# EAGLE design untitled (EAGLE 9.6.2)
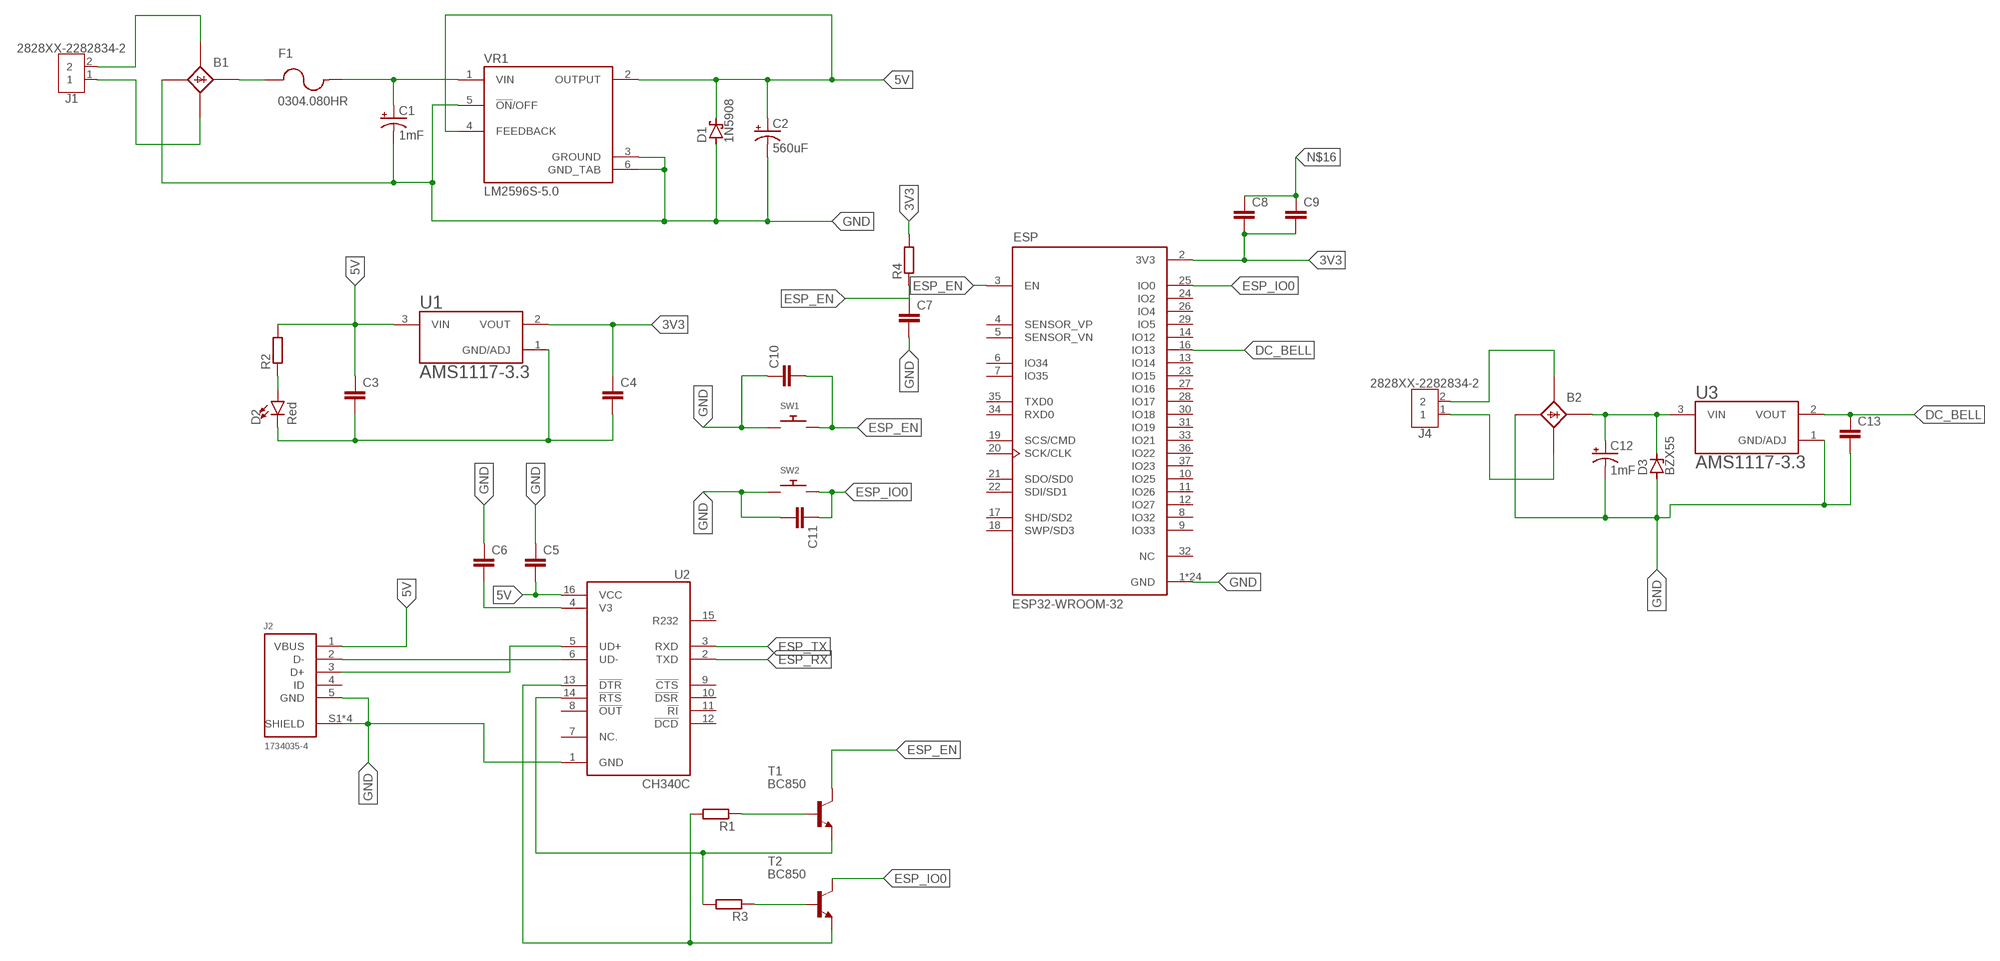
[diagram p0: schematic, sheet 1]

## Parts
B1  B25A-  [B25A-]
B2  B25A-  [B25A-]
C1  1mF  1000UF-RADIAL-5MM-25V-20%  [CPOL-RADIAL-5MM-10MM]
C2  560uF  560UF-PANASONIC_G-25V-20%  [PANASONIC_G]
C3  C-EUC1206K  [C1206K]
C4  C-EUC1206K  [C1206K]
C5  C-EUC1206K  [C1206K]
C6  C-EUC1206K  [C1206K]
C7  C-EUC1206K  [C1206K]
C8  C-EUC1206K  [C1206K]
C9  C-EUC1206K  [C1206K]
C10  C-EUC1206K  [C1206K]
C11  C-EUC1206K  [C1206K]
C12  1mF  1000UF-RADIAL-5MM-25V-20%  [CPOL-RADIAL-5MM-10MM]
C13  C-EUC1206K  [C1206K]
D1  1N5908  [C4111-15]
D2  Red  LED-RED-0603-WE  [LED-0603]
D3  BZX55  [DO35Z10]
ESP  ESP32-WROOM-32  [MODULE_ESP32-WROOM-32]
F1  0304.080HR  [0304.080HR]
J1  2828XX-2282834-2  [TERMBLK_254-2N]
J2  1734035-4  [1734035-4]
J4  2828XX-2282834-2  [TERMBLK_254-2N]
R1  R-EU_R5025W  [R5025W]
R2  R-EU_R5025W  [R5025W]
R3  R-EU_R5025W  [R5025W]
R4  R-EU_R5025W  [R5025W]
SW1  SWITCH_PUSHBUTTONSOFTTOUCHSMD_SJ  [PUSHBUTTON_SMD_SJ]
SW2  SWITCH_PUSHBUTTONSOFTTOUCHSMD_SJ  [PUSHBUTTON_SMD_SJ]
T1  BC850  [SOT23]
T2  BC850  [SOT23]
U1  AMS1117-3.3  [SOT229P700X180-4N]
U2  CH340C  [SOIC127P600X180-16N]
U3  AMS1117-3.3  [SOT229P700X180-4N]
VR1  LM2596S-5.0  [TO170P1524X483-6N]

## Nets
3V3: C4.1 C8.2 C9.2 ESP.2(3V3) R4.2 U1.2(VOUT)
5V: C2.+ C3.1 C5.2 D1.C J2.1(VBUS) R2.2 U1.3(VIN) U2.16(VCC) VR1.2(OUTPUT) VR1.4(FEEDBACK)
DC_BELL: C13.1 ESP.16(IO13) U3.2(VOUT)
ESP_EN: C7.1 C10.2 ESP.3(EN) R4.1 SW1.P$2 T1.3(C)
ESP_IO0: C11.1 ESP.25(IO0) SW2.P$2 T2.3(C)
ESP_RX: U2.2(TXD)
ESP_TX: U2.3(RXD)
GND: B1.-1(-) B2.-1(-) C1.- C2.- C5.1 C6.1 C7.2 C10.1 C11.2 C12.- C13.2 D1.A D3.A ESP.1(GND) ESP.15(GND) ESP.38(GND) ESP.39_1(GND) ESP.39_2(GND) ESP.39_3(GND) ESP.39_4(GND) ESP.39_5(GND) ESP.39_6(GND) ESP.39_7(GND) ESP.39_8(GND) ESP.39_9(GND) ESP.39_10(GND) ESP.39_11(GND) ESP.39_12(GND) ESP.39_13(GND) ESP.39_14(GND) ESP.39_15(GND) ESP.39_16(GND) ESP.39_17(GND) ESP.39_18(GND) ESP.39_19(GND) ESP.39_20(GND) ESP.39_21(GND) J2.5(GND) J2.S1(SHIELD) J2.S2(SHIELD) J2.S3(SHIELD) J2.S4(SHIELD) SW1.P$1 SW2.P$1 U2.1(GND) U3.1(GND/ADJ) VR1.3(GROUND) VR1.5(!ON!/OFF) VR1.6(GND_TAB)
N$1: B1.AC1-(AC1) J1.2
N$2: B1.AC2-(AC2) J1.1
N$3: B1.+1(+) F1.1
N$4: C1.+ F1.2 VR1.1(VIN)
N$5: D2.A R2.1
N$6: C3.2 C4.2 D2.C U1.1(GND/ADJ)
N$7: J2.3(D+) U2.5(UD+)
N$8: J2.2(D-) U2.6(UD-)
N$9: B2.AC1-(AC1) J4.2
N$10: B2.AC2-(AC2) J4.1
N$11: C6.2 U2.4(V3)
N$12: R1.1 T1.1(B)
N$13: R3.1 T2.1(B)
N$14: R3.2 T1.2(E) U2.14(!RTS)
N$15: R1.2 T2.2(E) U2.13(!DTR)
N$16: C8.1 C9.1
N$17: B2.+1(+) C12.+ D3.C U3.3(VIN)
Unconnected: B1.+ B1.- B1.AC1 B1.AC2 B2.+ B2.- B2.AC1 B2.AC2 ESP.4(SENSOR_VP) ESP.5(SENSOR_VN) ESP.6(IO34) ESP.7(IO35) ESP.8(IO32) ESP.9(IO33) ESP.10(IO25) ESP.11(IO26) ESP.12(IO27) ESP.13(IO14) ESP.14(IO12) ESP.17(SHD/SD2) ESP.18(SWP/SD3) ESP.19(SCS/CMD) ESP.20(SCK/CLK) ESP.21(SDO/SD0) ESP.22(SDI/SD1) ESP.23(IO15) ESP.24(IO2) ESP.26(IO4) ESP.27(IO16) ESP.28(IO17) ESP.29(IO5) ESP.30(IO18) ESP.31(IO19) ESP.32(NC) ESP.33(IO21) ESP.34(RXD0) ESP.35(TXD0) ESP.36(IO22) ESP.37(IO23) J2.4(ID) U2.7(NC.) U2.8(!OUT) U2.9(!CTS) U2.10(!DSR) U2.11(!RI) U2.12(!DCD) U2.15(R232)

## Library data of the parts
B1 B2 = rectifier:B25A-: RECTIFIER 25-A bridge
C1 C12 = SparkFun-Capacitors:1000UF: 1,000µF/1mF ceramic capacitors A capacitor is a passive two-terminal electrical component used to store electrical energy temporarily in an electric field. CAP-08070; PROD_ID: CAP-09538
C2 = SparkFun-Capacitors:560UF: 560µF polarized capacitors A capacitor is a passive two-terminal electrical component used to store electrical energy temporarily in an electric field.; PROD_ID: CAP-09983
C3-C11 C13 = rcl:C-EU: CAPACITOR, European symbol; SPICEPREFIX: C
D1 = diode:1N5908: DIODE schottky
D2 = SparkFun-LED:LED-RED: Red SMD LED Used in manufacturing of most products at SparkFun Packages: 0603 - KB - KingBright (DIO-17976) SMD 0603 package [Datasheet] <https://www.kingbrightusa.com/images/catalog/SPEC/APT1608SURCK.pdf> 0603 - (DIO-00819, has gone EOL) SMD 0603 package 0603 SMART - SMD 0603 SMART package ( more efficient and expensive)[Product Link] <http://www.osram-os.com/Graphics/XPic2/00077099_0.pdf> 1206 - SMD1206 package [Product Link] <https://www.sparkfun.com/datasheets/DevTools/LilyPad/Q150OVS4.pdff> SparkFun Products: Pro Mini 328 -5V <https://www.sparkfun.com/products/821> RedBoard <https://www.sparkfun.com/products/12757> IOIO-OTG <https://www.sparkfun.com/products/13613>; PROD_ID: DIO-16511
D3 = diode:BZX55: Z DIODE
ESP = ESP32-WROOM-32:ESP32-WROOM-32: Check availability <https://pricing.snapeda.com/parts/ESP32-WROOM-32/Espressif%20Systems/view-part?ref=eda>; AVAILABILITY: In Stock; CHECK_PRICES: https://www.snapeda.com/parts/ESP32-WROOM-32/Espressif+Systems/view-part/?ref=eda; DESCRIPTION: Bluetooth, WiFi 802.11b/g/n, Bluetooth v4.2 +EDR, Class 1, 2 and 3 Transceiver Module 2.4GHz ~ 2.5GHz Antenna Not Included, U.FL Surface Mount; MF: Espressif Systems; MP: ESP32-WROOM-32; PACKAGE: None; PRICE: None; SNAPEDA_LINK: https://www.snapeda.com/parts/ESP32-WROOM-32/Espressif+Systems/view-part/?ref=snap
F1 = Fuse:0304.080HR: FUSE BRD MNT 80MA 277VAC/DC 2SMD Manufacturer's datasheet <https://media.digikey.com/pdf/Data%20Sheets/Littelfuse%20PDFs/304_Series_Prelim.pdf>; CREATED_BY: PCBLayout.com; DIGIKEY_PARTNP: F8233TR-ND; MANUFACTURER: Littelfuse Inc.; MPN: 0304.080HR
J1 J4 = Connector:2828XX-2: 2 Position Wire to Board Terminal Block Horizontal with Board Datasheet <https://www.te.com.cn/commerce/DocumentDelivery/DDEController?Action=showdoc&DocId=Catalog+Section%7F1308389_EUROSTYLE_TERMINAL_BLOCKS%7F0607%7Fpdf%7FEnglish%7FENG_CS_1308389_EUROSTYLE_TERMINAL_BLOCKS_0607.pdf%7F2-282837-5>; CATEGORY: Fixed Terminal Blocks; DESCRIPTION: Fixed Terminal Blocks 2P SIDE ENTRY 2.54mm; MANUFACTURER: TE Connectivity AMP Connectors; MPN: 282834-2; OPERATING_TEMPERATURE: -40°C ~ 105°C; PART_STATUS: Active; PITCH: 0.100" (2.54mm); ROHS_COMPLIANCE: RoHS Compliant; SERIES: Buchanan; SUBCATEGORY: Terminal Blocks; TYPE: Through Hole; Screw - Rising Cage Clamp; Side wire entry, Horizontal with Board
J2 = USB connector:1734035-4: CONN RCPT USB2.0 MINI B SMD R/A Manufacturer's datasheet <https://www.te.com/commerce/DocumentDelivery/DDEController?Action=srchrtrv&DocNm=1734035&DocType=Customer+Drawing&DocLang=English>; CREATED_BY: PCBLayout.com; DIGIKEY_PARTNO: A121554TR-ND; MANUFACTURER: TE Connectivity AMP Connectors; MPN: 1734035-4
R1-R4 = rcl:R-EU_: RESISTOR, European symbol; SPICEPREFIX: R
SW1 SW2 = adafruit:SWITCH_PUSHBUTTON: Buttons SOFTTOUCHSMD_SJ - Soft touch temporary push button (Super Junk Akihabara) Compatible with SKPMANE010 [Mouser: 688-SKPMAN] C&K_KSS = Digikey: KSS221GLFS
T1 T2 = transistor:BC850: NPN TRANSISTOR
U1 U3 = AMS1117-3.3:AMS1117-3.3: Check availability <https://pricing.snapeda.com/parts/AMS1117-3.3/Advanced%20Monolithic%20Systems/view-part?ref=eda>; AVAILABILITY: Not in stock; CHECK_PRICES: https://www.snapeda.com/parts/AMS1117-3.3/Advanced+Monolithic+Systems/view-part/?ref=eda; DESCRIPTION: Sot223/Pkg 1-Amp 3.3-Volt Low Drop Out Voltage Regulatator; MF: Advanced Monolithic Systems; MP: AMS1117-3.3; PACKAGE: SOT-223 Seeed Technology; PRICE: None; SNAPEDA_LINK: https://www.snapeda.com/parts/AMS1117-3.3/Advanced+Monolithic+Systems/view-part/?ref=snap
U2 = CH340C:CH340C: USB to serial chip CH340 Check availability <https://pricing.snapeda.com/parts/CH340C/WCH/view-part?ref=eda>; AVAILABILITY: Not in stock; CHECK_PRICES: https://www.snapeda.com/parts/CH340C/WCH/view-part/?ref=eda; DESCRIPTION: USB to serial chip CH340; MF: WCH; MP: CH340C; PACKAGE: None; PRICE: None; SNAPEDA_LINK: https://www.snapeda.com/parts/CH340C/WCH/view-part/?ref=snap
VR1 = LM2596S-5.0:LM2596S-5.0: Check availability <https://pricing.snapeda.com/parts/LM2596S-5.0/Texas/view-part?ref=eda>; AVAILABILITY: In Stock; CHECK_PRICES: https://www.snapeda.com/parts/LM2596S-5.0/Texas+Instruments/view-part/?ref=eda; DESCRIPTION: SIMPLE SWITCHER® 4.5V to 40V, 3A Low Component Count Step-Down Regulator 5-DDPAK/TO-263; MF: Texas; MP: LM2596S-5.0; PACKAGE: TO-263-6 National Semiconductor; PRICE: None; SNAPEDA_LINK: https://www.snapeda.com/parts/LM2596S-5.0/Texas+Instruments/view-part/?ref=snap

## Board
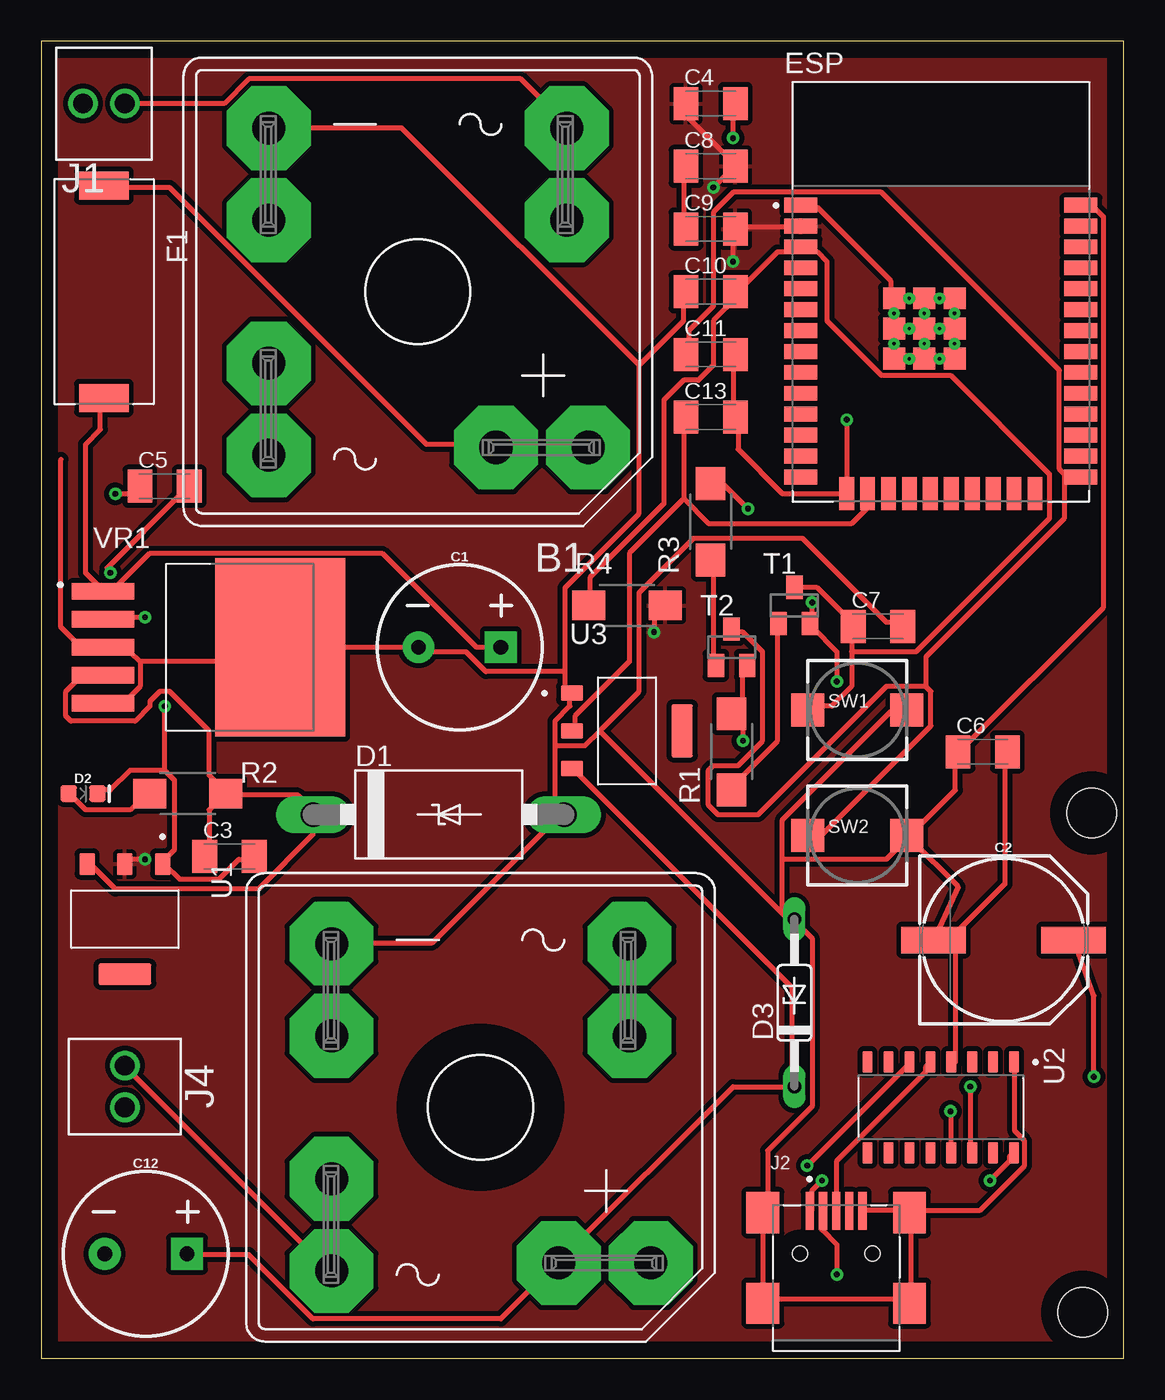
[diagram p1: board, top side]
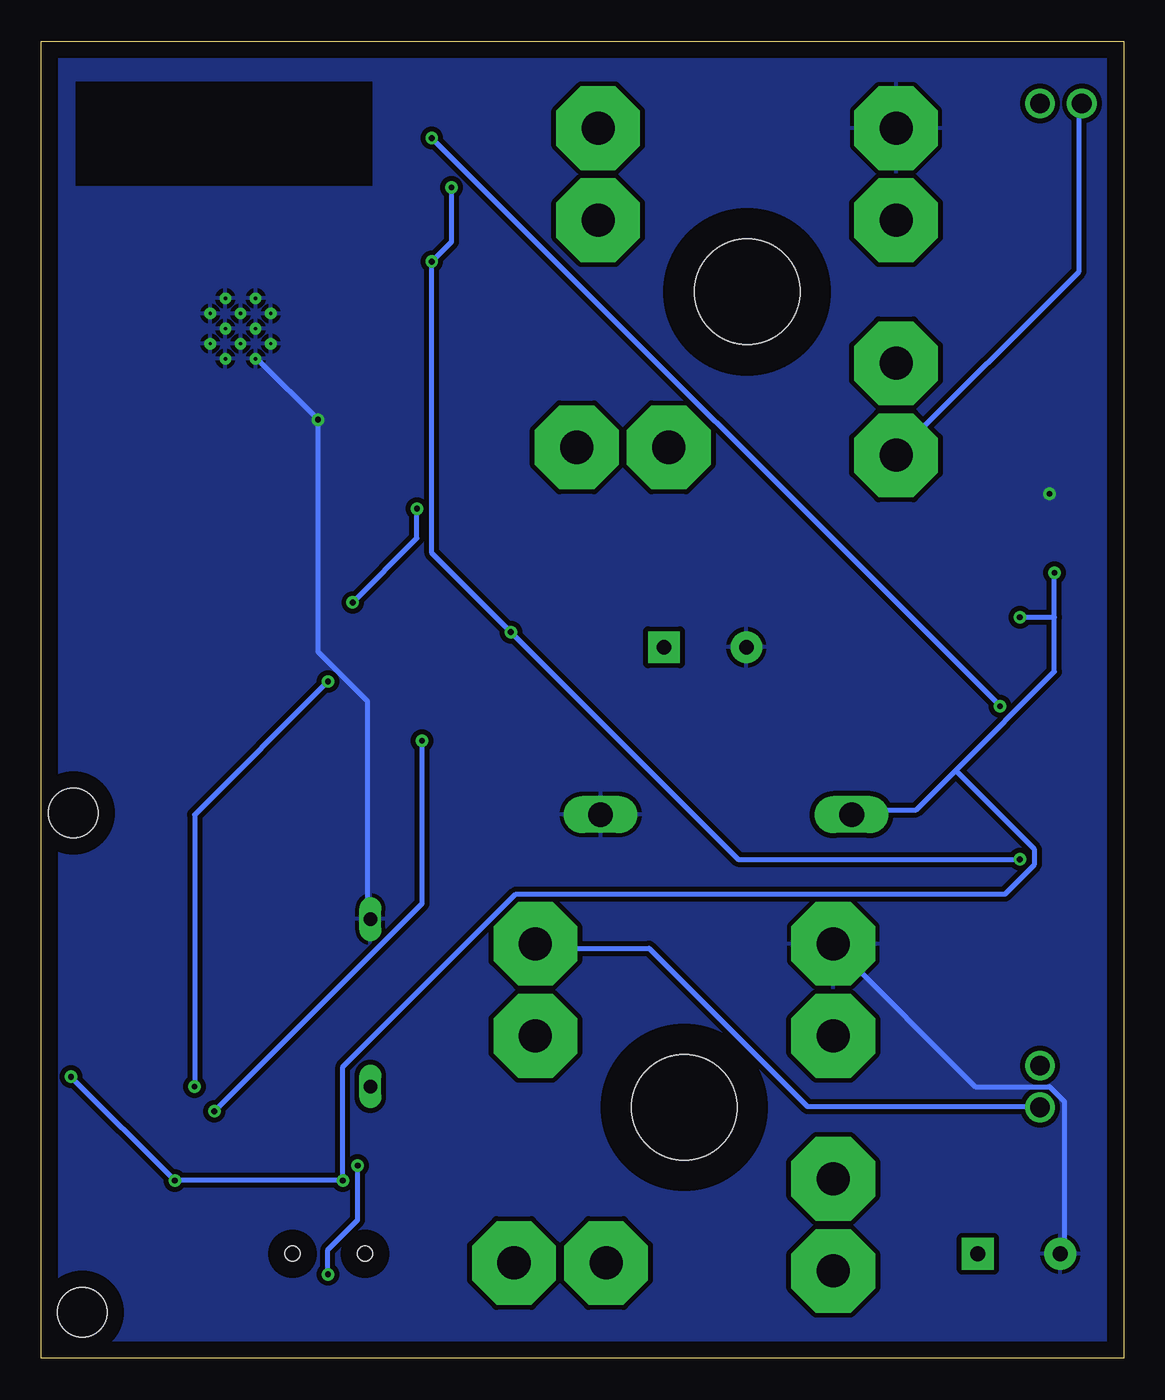
[diagram p2: board, bottom side, seen from below]

Size 65.71 x 79.98 mm. Coordinates in mm from the lower left corner, seen from the top.
Outline: 0,0 65.71,0 65.71,79.98 0,79.98 0,0
Copper layers (1*16): Top 0.035mm / dielectric 1.5mm / Bottom 0.035mm
Design rules "default *": minimum track width 0.3mm, minimum drill 0.35mm, track to track 0.3mm, track to pad 0.15mm, pad to pad 0.2mm, via to via 0.2mm, smd to smd 0.3mm, copper to edge 40mil, drill to drill 6mil, minimum pad ring 10mil, minimum via ring 8mil, stop-mask expansion 4mil, vias tented up to drill 0mil, thermal gap 10mil
Holes 3 mm at 63.77,33.12 63.23,2.8

### Footprints (pad centres in the part's own frame; a part is rotated, then mirrored left to right if it is on the bottom)
B25A- = drill 2.007 pad 5.08 octagon: + -10.338,9.449; +1 -4.75,9.449; - 9.042,-4.343; -1 9.042,-9.931; AC1 9.042,4.343; AC1- 9.042,9.931; AC2 -9.042,-4.343; AC2- -9.042,-9.931 | hole 6.401: 0,0
CPOL-RADIAL-5MM-10MM = drill 0.9 pad 1.93 square: + 2.5,0 | drill 0.9 pad 1.93: - -2.5,0
PANASONIC_G = smd 3.9 x 1.6: + 4.25,0; - -4.25,0
C1206K = smd 1.5 x 2: 1 -1.5,0; 2 1.5,0
C4111-15 = drill 1.499 long: A 7.62,0; C -7.62,0
LED-0603 = smd 1 x 1: A -0.877,0; C 0.877,0
DO35Z10 = drill 0.813 long: A 5.08,0; C -5.08,0
MODULE_ESP32-WROOM-32 = smd 2 x 0.9: 1 -8.5,5.26; 2 -8.5,3.99; 3 -8.5,2.72; 4 -8.5,1.45; 5 -8.5,0.18; 6 -8.5,-1.09; 7 -8.5,-2.36; 8 -8.5,-3.63; 9 -8.5,-4.9; 10 -8.5,-6.17; 11 -8.5,-7.44; 12 -8.5,-8.71; 13 -8.5,-9.98; 14 -8.5,-11.25; 25 8.5,-11.25; 26 8.5,-9.98; 27 8.5,-8.71; 28 8.5,-7.44; 29 8.5,-6.17; 30 8.5,-4.9; 31 8.5,-3.63; 32 8.5,-2.36; 33 8.5,-1.09; 34 8.5,0.18; 35 8.5,1.45; 36 8.5,2.72; 37 8.5,3.99; 38 8.5,5.26 | smd 0.9 x 2: 15 -5.715,-12.25; 16 -4.445,-12.25; 17 -3.175,-12.25; 18 -1.905,-12.25; 19 -0.635,-12.25; 20 0.635,-12.25; 21 1.905,-12.25; 22 3.175,-12.25; 23 4.445,-12.25; 24 5.715,-12.25 | smd 1.33 x 1.33: 39_1 -2.835,-0.405; 39_2 -1,-0.405; 39_3 0.835,-0.405; 39_4 -2.835,-2.24; 39_5 -1,-2.24; 39_6 0.835,-2.24; 39_7 -2.835,-4.075; 39_8 -1,-4.075; 39_9 0.835,-4.075 | drill 0.2 pad 0.3: 39_10 -1.917,-0.405; 39_11 -0.083,-0.405; 39_12 -2.835,-1.323; 39_13 -1,-1.323; 39_14 0.835,-1.323; 39_15 -1.917,-2.24; 39_16 -0.083,-2.24; 39_17 -2.835,-3.158; 39_18 -1,-3.158; 39_19 0.835,-3.158; 39_20 -1.917,-4.075; 39_21 -0.083,-4.075
0304.080HR = smd 1.7 x 3: 1 -6.45,0; 2 6.45,0
TERMBLK_254-2N = drill 1.2: 1 0,0; 2 2.54,0
1734035-4 = smd 0.5 x 2.3: 1 -1.6,2.6; 2 -0.8,2.6; 3 0,2.6; 4 0.8,2.6; 5 1.6,2.6 | smd 2 x 2.5: S1 -4.45,2.5; S2 4.45,2.5; S3 -4.45,-3; S4 4.45,-3 | hole 0.9: -2.2,0; 2.2,0
R5025W = smd 2 x 1.8: 1 -2.311,0; 2 2.311,0
PUSHBUTTON_SMD_SJ = smd 2 x 2: P$1 3,0; P$2 -3,0
SOT23 = smd 1 x 1.4: 1 -0.95,-1.1; 2 0.95,-1.1; 3 0,1.1
SOT229P700X180-4N = smd 1.31 x 0.93: 1 -3.345,2.29; 2 -3.345,0; 3 -3.345,-2.29 | smd 1.31 x 3.24: 4 3.345,0
SOIC127P600X180-16N = smd 1.31 x 0.62: 1 -2.75,4.445; 2 -2.75,3.175; 3 -2.75,1.905; 4 -2.75,0.635; 5 -2.75,-0.635; 6 -2.75,-1.905; 7 -2.75,-3.175; 8 -2.75,-4.445; 9 2.75,-4.445; 10 2.75,-3.175; 11 2.75,-1.905; 12 2.75,-0.635; 13 2.75,0.635; 14 2.75,1.905; 15 2.75,3.175; 16 2.75,4.445
TO170P1524X483-6N = smd 3.79 x 0.99: 1 -6.4,3.4; 2 -6.4,1.7; 3 -6.4,0; 4 -6.4,-1.7; 5 -6.4,-3.4 | smd 7.88 x 10.84: 6 4.35,0

### Placement (x,y rotation side)
B1  22.86,64.77 180 top
B2  26.67,15.24 180 top
C1  25.4,43.18 0 top
C2  58.42,25.4 0 top
C3  11.43,30.48 0 top
C4  40.64,76.2 0 top
C5  7.49,52.96 0 top
C6  57.15,36.83 0 top
C7  50.8,44.45 0 top
C8  40.64,72.39 0 top
C9  40.64,68.58 0 top
C10  40.64,64.77 0 top
C11  40.64,60.96 0 top
C12  6.35,6.35 0 top
C13  40.64,57.15 0 top
D1  24.13,33.02 0 top
D2  2.54,34.29 0 top
D3  45.72,21.59 90 top
ESP  54.61,64.77 0 top
F1  3.81,64.77 270 top
J1  5.08,76.2 180 top
J2  48.26,6.35 0 top
J4  5.08,15.24 90 top
R1  41.91,36.83 90 top
R2  8.89,34.29 0 top
R3  40.64,50.8 90 top
R4  35.56,45.72 0 top
SW1  49.53,39.37 0 top
SW2  49.53,31.75 0 top
T1  45.72,45.72 0 top
T2  41.91,43.18 0 top
U1  5.08,26.67 270 top
U2  54.61,15.24 270 top
U3  35.56,38.1 0 top
VR1  10.16,43.18 0 top

### Tracks (layer width: path | path; a pad name or v marks a point on that pad's centre or on a via)
3V3  (via drill 0.35)
  Top 0.3: C4.1 39.3,76.2 39.3,75.3 42,72.6 C8.2 42,72.3 v40.8,71.1 | ESP.2 45.9,68.7 42.3,68.7 C9.2 42,68.4 v42,66.6 | v6.3,30.3 5.1,30.3 U1.2 | v37.2,44.1 37.2,45 37.8,45.6 R4.2
  Bottom 0.3: v6.3,30.3 23.4,30.3 v37.2,44.1 42,48.9 v42,66.6 40.8,67.8 v40.8,71.1
  pour Top: 0,0 65.72,0 65.72,80 0,80
5V  (via drill 0.35)
  Top 0.3: C3.1 10.2,30.6 10.2,33.3 11.1,34.2 R2.2 | U1.3 3,30 4.5,28.5 13.2,28.5 16.5,31.8 16.5,33 D1.C 16.5,33.3 15.6,34.2 11.4,34.2 R2.2 | VR1.4 3.6,41.4 2.4,41.4 1.5,40.5 1.5,39 1.8,38.7 5.7,38.7 6.6,39.6 6.6,39.9 7.2,40.5 7.8,40.5 10.2,38.1 10.2,35.4 11.1,34.5 R2.2 | v6.3,45 3.9,45 VR1.2 | v57.6,10.8 58.8,12 58.8,12.3 U2.16 | v47.4,10.8 46.8,10.2 46.8,9 J2.1 | v63.9,17.1 63.9,22.02 C2.+ | C5.2 8.5,52.5 4,48 v4.2,47.7
  Bottom 0.3: 4.2,45 4.2,41.7 10.2,35.7 | 4.2,45 v4.2,47.7 | 10.2,35.7 12.6,33.3 16.5,33.3 D1.C | 4.2,45 v6.3,45 | v63.9,17.1 v57.6,10.8 v47.4,10.8 47.4,17.7 36.9,28.2 7.2,28.2 5.4,30 5.4,30.9 10.2,35.7
DC_BELL
  Top 0.3: 39,52.2 35.7,48.9 35.7,42.3 32.4,39 32.4,38.1 U3.2 | 39,52.2 39,57 C13.1 | 39,52.2 40.5,50.7 49.2,50.7 50.1,51.6 50.1,52.5 ESP.16
ESP_EN
  Top 0.3: T1.3 45.9,46.8 47.1,46.8 49.2,44.7 C7.1 49.2,44.4 49.2,42.9 | 49.2,42.9 49.2,40.8 48,39.6 46.8,39.6 SW1.P$2 | R4.1 33.3,45.9 33.3,47.4 37.8,51.9 37.8,58.2 39,59.4 39.9,59.4 40.8,60.3 40.8,63 42.3,64.5 C10.2 42.3,64.8 44.7,67.2 45.9,67.2 ESP.3 46.2,67.2 47.1,67.2 47.7,66.6 47.7,63 51,59.7 55.2,59.7 61.2,53.7 61.2,51 53.1,42.9 49.2,42.9
ESP_IO0
  Top 0.3: 53.7,40.8 51.3,40.8 43.5,33 41.1,33 40.5,33.6 40.5,35.7 40.8,36 42.3,36 43.8,37.5 43.8,42.9 42.6,44.1 42,44.1 T2.3 | 53.7,40.8 54,40.5 54,38.4 47.4,31.8 46.8,31.8 SW2.P$2 | 62.1,53.7 61.8,54 61.8,60 51,70.8 42,70.8 40.8,69.6 40.8,63.9 39.3,62.4 39.3,61.2 C11.1 | 62.1,53.7 63,53.7 ESP.25 | 53.7,40.8 53.7,42.6 62.1,51 62.1,53.7
GND  (via drill 0.35)
  Top 0.3: C11.2 42,60.9 42,57.3 C13.2 42.3,57 42.3,55.2 45,52.5 48.6,52.5 ESP.15 48.9,52.8 v48.9,57 | ESP.39_19 55.5,61.5 55.5,60.9 ESP.39_9 55.2,60.9 54.6,60.9 ESP.39_21 54.3,60.9 53.7,60.9 | 53.7,62.7 53.7,63.3 ESP.39_13 | 53.7,60.9 53.7,61.5 ESP.39_18 | 51.9,60.9 51.9,61.5 ESP.39_17 51.9,61.8 51.9,62.4 ESP.39_4 51.9,62.7 | 51.9,62.7 51.9,63.3 ESP.39_12 | 51.9,60.9 52.5,60.9 ESP.39_20 52.8,60.9 53.4,60.9 ESP.39_8 53.7,60.9 | 51.9,60.9 ESP.39_7 | 51.9,62.7 52.5,62.7 ESP.39_15 52.8,62.7 53.4,62.7 ESP.39_5 53.7,62.7 | 53.7,62.7 54.3,62.7 ESP.39_16 54.6,62.7 55.2,62.7 ESP.39_6 55.5,62.7 55.5,63.3 ESP.39_14 55.5,63.6 55.5,64.2 ESP.39_3 55.2,64.5 54.6,64.5 ESP.39_11 54.3,64.5 53.7,64.5 ESP.39_2 53.4,64.5 52.8,64.5 ESP.39_10 52.5,64.5 51.9,64.5 ESP.39_1 51.6,64.5 51.6,65.4 47.1,69.9 46.2,69.9 ESP.1 | U2.1 59.1,17.7 59.1,13.8 59.7,13.2 59.7,11.7 57,9 52.8,9 J2.S2 | J2.5 50.1,9 52.5,9 J2.S2 | J2.S2 52.8,8.7 52.8,3.6 J2.S4 52.5,3.6 44.1,3.6 J2.S3 43.8,3.6 43.8,8.7 J2.S1 44.1,9 44.1,12.6 46.8,15.3 46.8,25.5 45.9,26.4 D3.A 45.6,26.7 | 45,30.3 45,27.3 45.6,26.7 | 45,30.3 45,32.7 51.6,39.3 52.5,39.3 SW1.P$1 | SW2.P$1 52.8,31.5 55.66,28.64 C2.- | SW2.P$1 52.8,31.8 55.5,34.5 55.5,36.6 C6.1 55.8,36.9 64.5,45.6 64.5,69.3 63.9,69.9 63.3,69.9 ESP.38 | 45,30.3 51.3,30.3 52.5,31.5 SW2.P$1 | 1.2,54.58 1.2,44.4 2.4,43.2 3.6,43.2 VR1.3 3.9,42.9 5.4,42.9 6,42.3 | 6,42.3 6,40.8 5.1,39.9 3.9,39.9 VR1.5 | 6,42.3 13.8,42.3 14.4,42.9 VR1.6 14.7,43.2 22.8,43.2 C1.- 23.1,42.9 25.8,42.9 27,41.7 31.8,41.7 | 31.2,37.2 31.2,33.6 31.5,33.3 D1.A 31.5,33 23.7,25.2 17.7,25.2 B2.-1 | 31.2,37.2 31.2,38.7 32.1,39.6 32.1,40.2 U3.1 32.1,40.5 31.8,40.8 31.8,41.7
  Top 0.3: 33.9,38.1 33,37.2 31.2,37.2 | 33.9,38.1 36.3,40.5 36.3,46.5 39.6,49.8 46.2,49.8 51.3,44.7 52.2,44.7 C7.2 | 36.3,60.3 39,63 39,64.5 C10.1 | 36.3,60.3 36.3,51.3 31.8,46.8 31.8,41.7 | 36.3,60.3 21.9,74.7 14.1,74.7 B1.-1 | 45.6,26.7 45.3,26.7 33.9,38.1 | v4.5,52.5 5.5,52.5 C5.1
  Bottom 0.3: ESP.39_20 52.5,60.6 v48.9,57 48.9,42.9 45.9,39.9 45.9,26.7 D3.A | C12.- 3.6,6.6 3.6,15.6 4.5,16.5 9,16.5 17.4,24.9 B2.-1
  pour Bottom: 0,0 65.72,0 65.72,80 0,80
N$1
  Bottom 0.3: J1.2 2.7,76.2 2.7,66 13.8,54.9 B1.AC1-
N$2
  Top 0.3: J1.1 11.1,76.2 12.6,77.7 29.1,77.7 31.8,75 B1.AC2-
N$3
  Top 0.3: F1.1 3.9,71.1 7.8,71.1 23.4,55.5 27.6,55.5 B1.+1
N$4
  Top 0.3: F1.2 3.6,58.2 3.6,56.4 2.7,55.5 2.7,47.7 3.6,46.8 VR1.1 3.9,46.8 4.5,46.8 6.6,48.9 20.7,48.9 26.4,43.2 27.9,43.2 C1.+
N$5
  Top 0.3: D2.A 1.8,34.2 2.7,33.3 5.4,33.3 6.3,34.2 R2.1
N$6  (via drill 0.35)
  Top 0.3: 7.5,35.7 5.4,35.7 4.2,34.5 3.6,34.5 D2.C | 7.5,35.7 8.1,35.1 8.1,30.9 7.5,30.3 U1.1 7.5,30 8.4,29.1 10.8,29.1 12,30.3 12.9,30.3 C3.2 | v42,74.1 42,76.2 C4.2 | 7.5,35.7 v7.5,39.6
  Bottom 0.3: v7.5,39.6 v42,74.1
N$7
  Top 0.3: U2.5 53.7,17.7 53.7,17.4 48.3,12 48.3,9 J2.3
N$8  (via drill 0.35)
  Top 0.3: v46.5,11.7 52.5,17.7 U2.6 | v48.3,5.1 48.3,6.9 47.4,7.8 47.4,8.7 J2.2
  Bottom 0.3: v46.5,11.7 46.5,8.4 48.3,6.6 v48.3,5.1
N$9
  Top 0.3: J4.2 5.1,17.7 17.4,5.4 B2.AC1-
N$10
  Bottom 0.3: J4.1 5.1,15.3 19.2,15.3 28.8,24.9 35.7,24.9 B2.AC2-
N$11
  Top 0.3: U2.4 55.5,18 55.5,25.8 58.5,28.8 58.5,36.6 C6.2
N$12
  Top 0.3: T1.1 44.7,44.4 44.7,37.5 42,34.8 R1.1
N$13
  Top 0.3: T2.1 40.8,42.3 40.8,48.3 R3.1
N$14  (via drill 0.35)
  Top 0.3: v56.4,16.5 56.4,12.6 U2.14 | v48.3,41.1 48.3,42.9 46.8,44.4 T1.2 46.8,44.7 v46.8,45.9 | v42.9,51.6 41.4,53.1 40.8,53.1 R3.2
  Bottom 0.3: v56.4,16.5 56.4,33 v48.3,41.1 | v42.9,51.6 42.9,49.8 v46.8,45.9
N$15  (via drill 0.35)
  Top 0.3: v55.2,15 55.2,12.6 U2.13 | v42.6,37.5 42.6,38.4 42,39 R1.2 42,39.3 42.6,39.9 42.6,42 T2.2
  Bottom 0.3: v55.2,15 42.6,27.6 v42.6,37.5
N$16
  Top 0.3: C9.1 39,68.7 39,72.3 C8.1
N$17
  Top 0.3: U3.3 32.4,35.7 45.6,22.5 45.6,16.8 D3.C 45.6,16.5 42,16.5 31.5,6 B2.+1 31.2,5.7 27.9,2.4 16.5,2.4 12.6,6.3 9,6.3 C12.+